# Altium project RF Oscillator - R1.PrjPcb
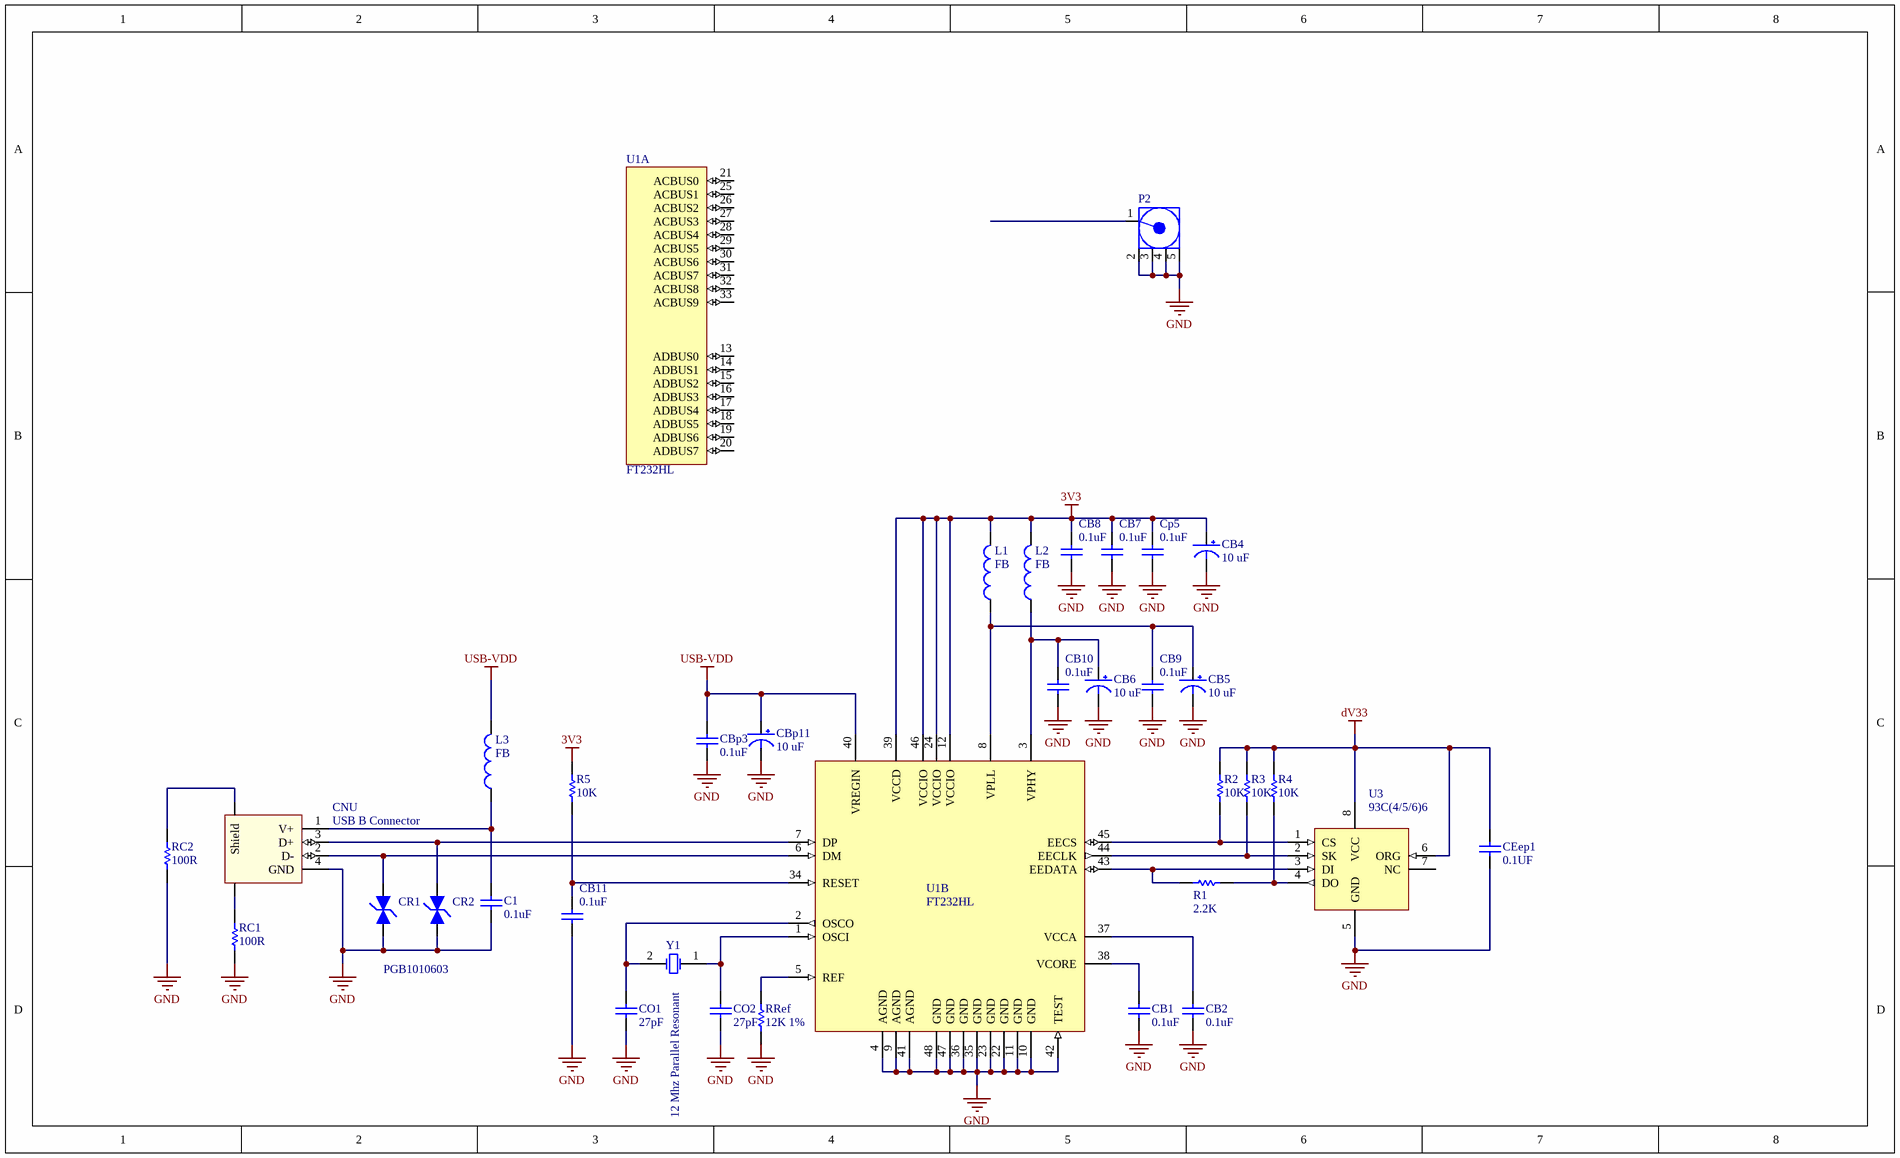
[diagram p0: Main.SchDoc]
1 sheet, 35 parts. Net scope: global (net labels, ports and power ports of the same name join across sheets).
Board file: Main.PcbDoc

## Sheet Main.SchDoc
size Legal

### Parts
C1  value 0.1uF  [0805C]  (hidden comment: Cap Semi)
CB1  value 0.1uF  [0603C]  (hidden comment: Cap Semi)
CB2  value 0.1uF  [0603C]  (hidden comment: Cap Semi)
CB4  10 uF  [B]
CB5  10 uF  [B]
CB6  10 uF  [B]
CB7  value 0.1uF  [0603C]  (hidden comment: Cap Semi)
CB8  value 0.1uF  [0603C]  (hidden comment: Cap Semi)
CB9  value 0.1uF  [0603C]  (hidden comment: Cap Semi)
CB10  value 0.1uF  [0603C]  (hidden comment: Cap Semi)
CB11  value 0.1uF  [0603C]  (hidden comment: Cap Semi)
CBp3  value 0.1uF  [0603C]  (hidden comment: Cap Semi)
CBp11  10 uF  [B]
CEep1  value 0.1UF  [0805C]  (hidden comment: Cap Semi)
CNU  USB B Connector  [USB Connector (type B)]
CO1  value 27pF  [0805C]  (hidden comment: Cap Semi)
CO2  value 27pF  [0805C]  (hidden comment: Cap Semi)
Cp5  value 0.1uF  [0603C]  (hidden comment: Cap Semi)
CR1  PGB1010603  [0603PG]  (value not drawn)
CR2  PGB1010603  [0603PG]
L1  value FB  [1206F]  (hidden comment: Inductor)
L2  value FB  [1206F]  (hidden comment: Inductor)
L3  value FB  [1206F]  (hidden comment: Inductor)
P2  COAX-M  [SMA Jack - PCB Edge - MultiSize]  (value not drawn)
R1  value 2.2K  [0603R]  (hidden comment: Res Semi)
R2  value 10K  [0603R]  (hidden comment: Res Semi)
R3  value 10K  [0603R]  (hidden comment: Res Semi)
R4  value 10K  [0603R]  (hidden comment: Res Semi)
R5  value 10K  [0805r]  (hidden comment: Res Semi)
RC1  value 100R  [1206R]  (hidden comment: Res Semi)
RC2  value 100R  [1206R]  (hidden comment: Res Semi)
RRef  value 12K 1%  [1206R]  (hidden comment: Res Semi)
U1  FT232HL  [TSQFP50P900X900-48N]  (parts A,B of 2)
U3  93C(4/5/6)6  [SOIC127P600-8CN]
Y1  12 Mhz Parallel Resonant  [HC-49]

### Nets
3V3: CB4.1 CB7.1 CB8.1 Cp5.1 L1.2 L2.2 R5.1 U1.12(VCCIO) U1.24(VCCIO) U1.39(VCCD) U1.46(VCCIO)
dV33: CEep1.1 R2.1 R3.1 R4.1 U3.6(ORG) U3.8(VCC)
GND: C1.1 CB1.2 CB2.2 CB4.2 CB5.2 CB6.2 CB7.2 CB8.2 CB9.2 CB10.2 CB11.2 CBp3.2 CBp11.2 CEep1.2 CNU.4(GND) CO1.2 CO2.2 Cp5.2 CR1.2 CR2.2 P2.2(GND) P2.3(GND) P2.4(GND) P2.5(GND) RC1.1 RC2.1 RRef.1 U1.4(AGND) U1.9(AGND) U1.10(GND) U1.11(GND) U1.22(GND) U1.23(GND) U1.35(GND) U1.36(GND) U1.41(AGND) U1.42(TEST) U1.47(GND) U1.48(GND) U3.5(GND)
USB-VDD: CBp3.1 CBp11.1 L3.2 U1.40(VREGIN)
NetC1_2: C1.2 CNU.1(V+) L3.1
NetCB1_1: CB1.1 U1.38(VCORE)
NetCB2_1: CB2.1 U1.37(VCCA)
NetCB5_1: CB5.1 CB9.1 L1.1 U1.8(VPLL)
NetCB6_1: CB6.1 CB10.1 L2.1 U1.3(VPHY)
NetCB11_1: CB11.1 R5.2 U1.34(RESET)
NetCNU_2: CNU.2(D-) CR1.1 U1.6(DM)
NetCNU_3: CNU.3(D+) CR2.1 U1.7(DP)
NetCNU_5: CNU.5(Gnd) RC1.2
NetCNU_6: CNU.6(Shield) RC2.2
NetCO1_1: CO1.1 U1.2(OSCO) Y1.2(OSC2)
NetCO2_1: CO2.1 U1.1(OSCI) Y1.1(OSC1)
NetR1_1: R1.1 R4.2 U3.4(DO)
NetR1_2: R1.2 U1.43(EEDATA) U3.3(DI)
NetR2_2: R2.2 U1.45(EECS) U3.1(CS)
NetR3_2: R3.2 U1.44(EECLK) U3.2(SK)
NetRRef_2: RRef.2 U1.5(REF)

Not connected (* = marked no-connect by the designer): P2 1(Signal); U1 13(ADBUS0) 14(ADBUS1) 15(ADBUS2) 16(ADBUS3) 17(ADBUS4) 18(ADBUS5) 19(ADBUS6) 20(ADBUS7) 21(ACBUS0) 25(ACBUS1) 26(ACBUS2) 27(ACBUS3) 28(ACBUS4) 29(ACBUS5) 30(ACBUS6) 31(ACBUS7) 32(ACBUS8) 33(ACBUS9); U3 7(NC)

### Library data of the parts
C1 CB1 CB2 CB7-CB11 CBp3 CEep1 CO1 CO2 Cp5 = Cap Semi: Capacitor (Semiconductor SIM Model); Published: 8-Jun-2000; LatestRevisionDate: 29-May-2009; LatestRevisionNote: IPC-7351 Footprint Added.; PackageReference: C1206; Publisher: Altium Limited; PackageDescription: Chip Capacitor
CB4-CB6 CBp11 = 100 uf SMT Panasonic Cap
CNU = USB B connector - Through hole
CR1 CR2 = PGB1010603: PulseGuard® Lead-Free 0603 Surface Mount Polymeric ESD Suppressors
L1-L3 = Inductor: Code_IEC: 1005; Published: 8-Jun-2000; LatestRevisionDate: 17-Jul-2002; LatestRevisionNote: Re-released for DXP Platform.; PackageReference: 0402-A; Publisher: Altium Limited; Code_JEITA: 0402
P2 = COAX-M: RF Coaxial PCB Connector, MMCX; Thru-Hole, Vertical Mount Plug,  50 Ohm Impedance; PackageDocument: Rev. A, 16-Jun-1997; PCB_Layout: Complies with manufacturer's recommendation.; DrillSize: Corresponds to nominal value.; Published: 15-Jul-2004; LatestRevisionDate: 15-Jul-2004; LatestRevisionNote: Component Replaced.; DatasheetDocument: 30-May-2003; PackageReference: 908-21103; Publisher: Altium Limited; ComponentLink1Description: Manufacturer Link; ComponentLink1URL: http://www.amphenolrf.com/
R1-R5 RC1 RC2 RRef = Res Semi: Semiconductor Resistor; Published: 8-Jun-2000; LatestRevisionDate: 17-Jul-2002; LatestRevisionNote: Re-released for DXP Platform.; PackageReference: AXIAL-0.5; Publisher: Altium Limited
U1 = FT232HL: Hi-Speed Single Channel USB UART/FIFO IC; DKPN: 768-1101-1-ND; Datasheet: http://www.ftdichip.com/Support/Documents/DataSheets/ICs/DS_FT232H.pdf
U3 = 93C(4/5/6)6: 1/2/4K 3-Wire Serial EEPROM
Y1 = ECS-10-13-1: Crystal Oscillator; Published: 17-Jul-2002; DatasheetDocument: 18-Apr-2000; PackageReference: HC-49U; Publisher: Altium Limited; ComponentLink1Description: Manufacturer Link; ComponentLink1URL: http://www.ecsxtal.com/; ComponentLink2Description: Datasheet; ComponentLink2URL: http://www.ecsxtal.com/pdf2/HC49U.PDF